# EAGLE schematic eom_test_pcb_v2 (EAGLE 9.6.2)
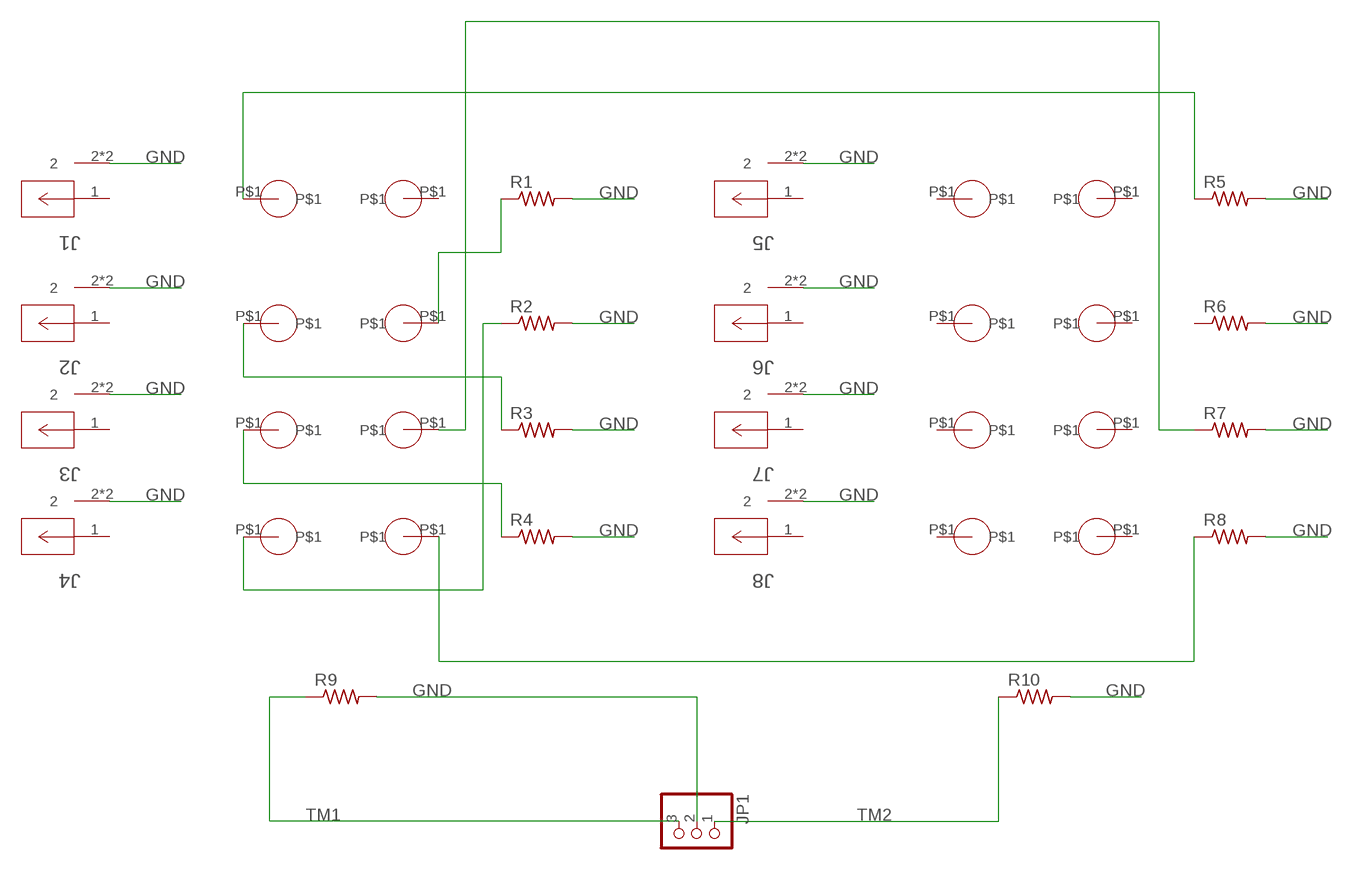
[diagram p0: schematic, sheet 1]

## Parts
J1  142-0711-821  [CONN_142-0711-821_CIN]
J2  142-0711-821  [CONN_142-0711-821_CIN]
J3  142-0711-821  [CONN_142-0711-821_CIN]
J4  142-0711-821  [CONN_142-0711-821_CIN]
J5  142-0711-821  [CONN_142-0711-821_CIN]
J6  142-0711-821  [CONN_142-0711-821_CIN]
J7  142-0711-821  [CONN_142-0711-821_CIN]
J8  142-0711-821  [CONN_142-0711-821_CIN]
JP1  PINHD-1X3  [1X03]
R1  R-US_M1206  [M1206]
R2  R-US_M1206  [M1206]
R3  R-US_M1206  [M1206]
R4  R-US_M1206  [M1206]
R5  R-US_M1206  [M1206]
R6  R-US_M1206  [M1206]
R7  R-US_M1206  [M1206]
R8  R-US_M1206  [M1206]
R9  R-US_R0402  [R0402]
R10  R-US_R0402  [R0402]
U$1  SIGNAL_BONDING_DEVICE  [SIGNAL_BONDING_PAD]
U$2  SIGNAL_BONDING_DEVICE  [SIGNAL_BONDING_PAD]
U$3  SIGNAL_BONDING_DEVICE  [SIGNAL_BONDING_PAD]
U$4  SIGNAL_BONDING_DEVICE  [SIGNAL_BONDING_PAD]
U$5  SIGNAL_BONDING_DEVICE  [SIGNAL_BONDING_PAD]
U$6  SIGNAL_BONDING_DEVICE  [SIGNAL_BONDING_PAD]
U$7  SIGNAL_BONDING_DEVICE  [SIGNAL_BONDING_PAD]
U$8  SIGNAL_BONDING_DEVICE  [SIGNAL_BONDING_PAD]
U$9  SIGNAL_BONDING_DEVICE  [SIGNAL_BONDING_PAD]
U$10  SIGNAL_BONDING_DEVICE  [SIGNAL_BONDING_PAD]
U$11  SIGNAL_BONDING_DEVICE  [SIGNAL_BONDING_PAD]
U$12  SIGNAL_BONDING_DEVICE  [SIGNAL_BONDING_PAD]
U$13  SIGNAL_BONDING_DEVICE  [SIGNAL_BONDING_PAD]
U$14  SIGNAL_BONDING_DEVICE  [SIGNAL_BONDING_PAD]
U$15  SIGNAL_BONDING_DEVICE  [SIGNAL_BONDING_PAD]
U$16  SIGNAL_BONDING_DEVICE  [SIGNAL_BONDING_PAD]

## Nets
GND: J1.2 J1.3 J2.2 J2.3 J3.2 J3.3 J4.2 J4.3 J5.2 J5.3 J6.2 J6.3 J7.2 J7.3 J8.2 J8.3 JP1.2 R1.2 R2.2 R3.2 R4.2 R5.2 R6.2 R7.2 R8.2 R9.2 R10.2
N$1: R7.1 U$6.P$1
N$2: R8.1 U$8.P$1
N$3: R3.1 U$3.P$1
N$4: R4.1 U$5.P$1
N$5: R5.1 U$1.P$1
N$6: R2.1 U$7.P$1
N$7: R1.1 U$4.P$1
TM1: JP1.3 R9.1
TM2: JP1.1 R10.1
Unconnected: J1.1 J2.1 J3.1 J4.1 J5.1 J6.1 J7.1 J8.1 R6.1 U$2.P$1 U$9.P$1 U$10.P$1 U$11.P$1 U$12.P$1 U$13.P$1 U$14.P$1 U$15.P$1 U$16.P$1

## Library data of the parts
J1-J8 = eom_chip_lib:142-0711-821; COPYRIGHT: Copyright (C) 2021 Ultra Librarian. All rights reserved.; MANUFACTURER_PART_NUMBER: 142-0711-821; MFR_NAME: Cinch Connectivity Solutions
JP1 = adafruit:PINHD-1X3: PIN HEADER
R1-R10 = adafruit:R-US_: RESISTOR, American symbol
U$1-U$16 = eom_chip_lib:SIGNAL_BONDING_DEVICE